# Altium schematic sheet TMC2130.SchDoc
size A
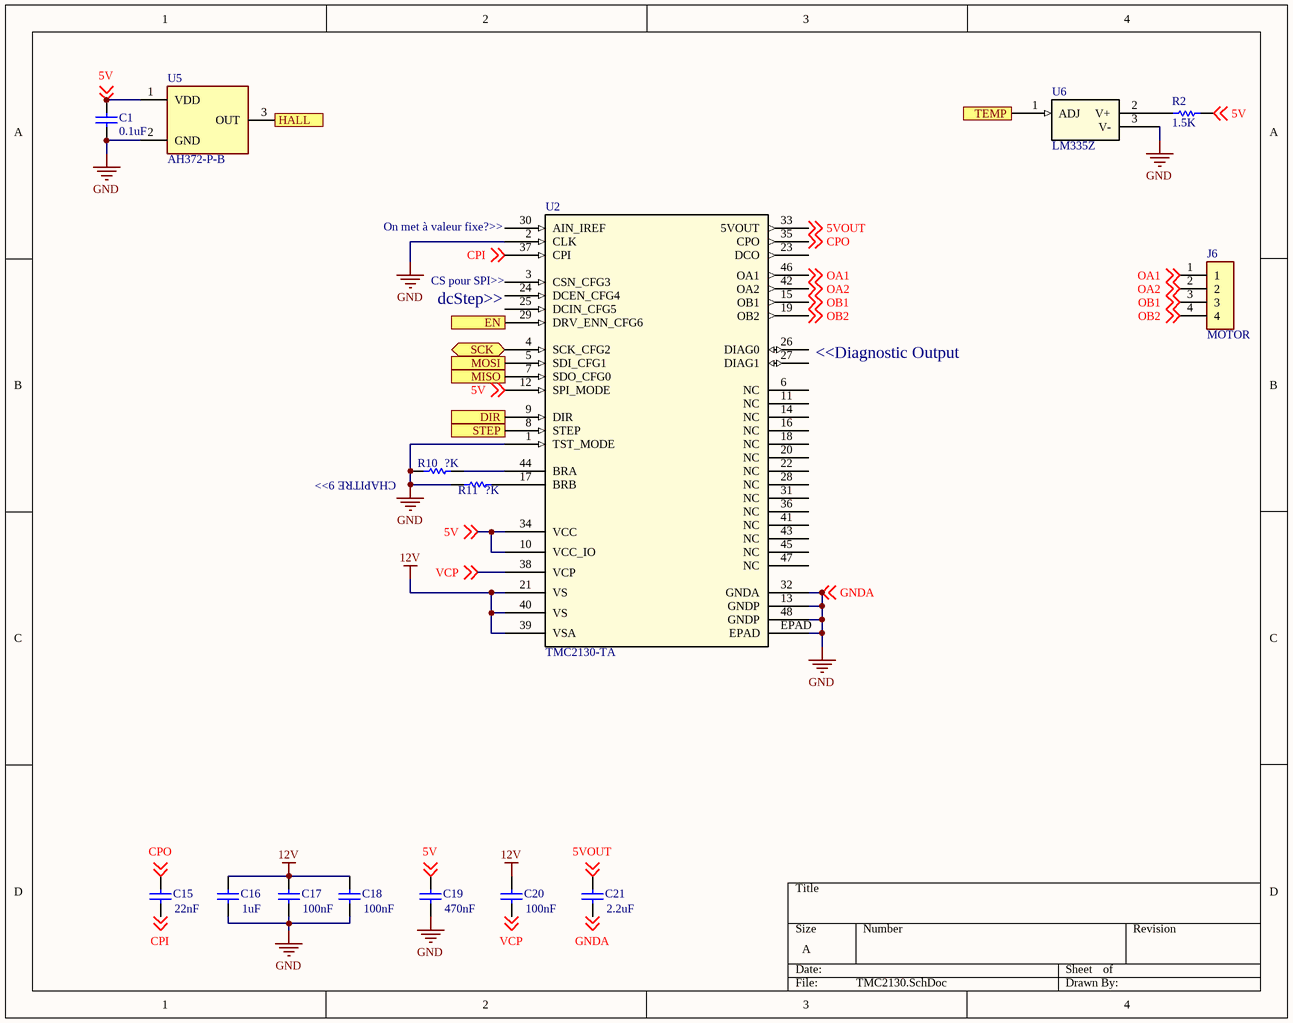
[diagram p0: TMC2130.SchDoc]

## Parts
C1  value 0.1uF  [RAD-0.3]
C15  value 22nF  [RAD-0.3]  (hidden comment: Cap)
C16  value 1uF  [RAD-0.3]  (hidden comment: Cap)
C17  value 100nF  [RAD-0.3]  (hidden comment: Cap)
C18  value 100nF  [RAD-0.3]  (hidden comment: Cap)
C19  value 470nF  [RAD-0.3]  (hidden comment: Cap)
C20  value 100nF  [RAD-0.3]  (hidden comment: Cap)
C21  value 2.2uF  [RAD-0.3]  (hidden comment: Cap)
J6  MOTOR  [SHDR4W64P0X250_1X4_1240X1155X700P]
R2  value 1.5K  [AXIAL-0.3]
R10  value ?K  [AXIAL-0.3]  (hidden comment: Res1)
R11  value ?K  [AXIAL-0.3]  (hidden comment: Res1)
U2  TMC2130-TA  [eTQFP48_9x9]
U5  AH372-P-B  [AH372PB]
U6  LM335Z  [TO92]

## Ports
DIR (in), EN (in), HALL (out), MISO (out), MOSI (in), SCK (bidir), STEP (in), TEMP (out)

## Nets
12V: C16.2 C17.2 C18.2 C20.2 U2.21(VS) U2.39(VSA) U2.40(VS)
GND: C1.1 C16.1 C17.1 C18.1 C19.1 C21.1 R10.1 R11.1 U2.1(TST_MODE) U2.2(CLK) U2.13(GNDP) U2.32(GNDA) U2.48(GNDP) U2.EPAD U5.2(GND) U6.3(V-) ; off-sheet GNDA  [also labelled GNDA]
5V: C1.2 C19.2 R2.1 U2.10(VCC_IO) U2.12(SPI_MODE) U2.34(VCC) U5.1(VDD) ; off-sheet 5V
5VOUT: C21.2 U2.33(5VOUT) ; off-sheet 5VOUT
CPI: C15.1 U2.37(CPI) ; off-sheet CPI
CPO: C15.2 U2.35(CPO) ; off-sheet CPO
DIR: U2.9(DIR) ; port DIR
EN: U2.29(DRV_ENN_CFG6) ; port EN
HALL: U5.3(OUT) ; port HALL
MISO: U2.7(SDO_CFG0) ; port MISO
MOSI: U2.5(SDI_CFG1) ; port MOSI
OA1: J6.1 U2.46(OA1) ; off-sheet OA1
OA2: J6.2 U2.42(OA2) ; off-sheet OA2
OB1: J6.3 U2.15(OB1) ; off-sheet OB1
OB2: J6.4 U2.19(OB2) ; off-sheet OB2
SCK: U2.4(SCK_CFG2) ; port SCK
STEP: U2.8(STEP) ; port STEP
TEMP: U6.1(ADJ) ; port TEMP
VCP: C20.1 U2.38(VCP) ; off-sheet VCP
NetR2_2: R2.2 U6.2(V+)
NetR10_2: R10.2 U2.44(BRA)
NetR11_2: R11.2 U2.17(BRB)

Not connected (* = marked no-connect by the designer): U2 3(CSN_CFG3) 6(NC) 11(NC) 14(NC) 16(NC) 18(NC) 20(NC) 22(NC) 23(DCO) 24(DCEN_CFG4) 25(DCIN_CFG5) 26(DIAG0) 27(DIAG1) 28(NC) 30(AIN_IREF) 31(NC) 36(NC) 41(NC) 43(NC) 45(NC) 47(NC)

## Notes on the sheet
- (near U2) On met à valeur fixe?>>
- (near U2) CS pour SPI>>
- (near U2) dcStep>>
- (near U2) <<Diagnostic Output
- (near R10) CHAPITRE 9>>

## Library data of the parts
C1 C15-C21 = Cap: Capacitor; Published: 8-Jun-2000; LatestRevisionDate: 17-Jul-2002; LatestRevisionNote: Re-released for DXP Platform.; PackageReference: RAD-0.3; Publisher: Altium Limited; PackageDescription: Radial Cap, Thru-Hole; 2 Leads; 0.3 in Pin Spacing
J6 = JST 4POS: Connector; Manufacturer_Name: JST (JAPAN SOLDERLESS TERMINALS); Manufacturer_Part_Number: S4B-XH-A(LF)(SN); Datasheet Link: http://www.jst-mfg.com/product/pdf/eng/eXH.pdf; Height: 7mm; RS Part Number: 8201589P; RS Price/Stock: http://uk.rs-online.com/web/p/products/8201589P
R2 R10 R11 = Res1: Resistor; Published: 8-Jun-2000; LatestRevisionDate: 17-Jul-2002; LatestRevisionNote: Re-released for DXP Platform.; PackageReference: AXIAL-0.3; Publisher: Altium Limited; PackageDescription: Axial Device, Thru-Hole; 2 Leads; 0.3 in Pin Spacing
U2 = TMC2130-TA: Motor Driver TMC2130; Built_By: EMA_Jessica; Vendor: TRINAMIC; Copyright: Copyright (C) 2016 Accelerated Designs. All rights reserved; Manufacturer_Part_Number: TMC2130-TA; RefDes: RefDes; Type: DEV; Value: Value
U5 = AH372-P-B: Hall Sensor; Manufacturer_Name: Diodes Inc.; Datasheet Link: https://www.mouser.com/datasheet/2/115/AH372-1317530.pdf; Height: 4.75mm; Manufacturer_Part_Number: AH372-P-B; Mouser Part Number: 621-AH372-P-B; Mouser Price/Stock: https://www.mouser.com/Search/Refine.aspx?Keyword=621-AH372-P-B; RS Part Number: 1333361P; RS Price/Stock: http://uk.rs-online.com/web/p/products/1333361P
U6 = LM335Z: Temperature Sensor; VENDOR: STMicroelectronics; Built_By: EMA_UL_Team; MANUFACTURER_PART_NUMBER: LM335Z; Copyright: Copyright (C) 2018 Accelerated Designs. All rights reserved; RefDes: RefDes; Type: DEV; Value: Value